# Altium schematic sheet OVERVIEW.SchDoc
size A; SheetNumber: 1; SheetTotal: 3
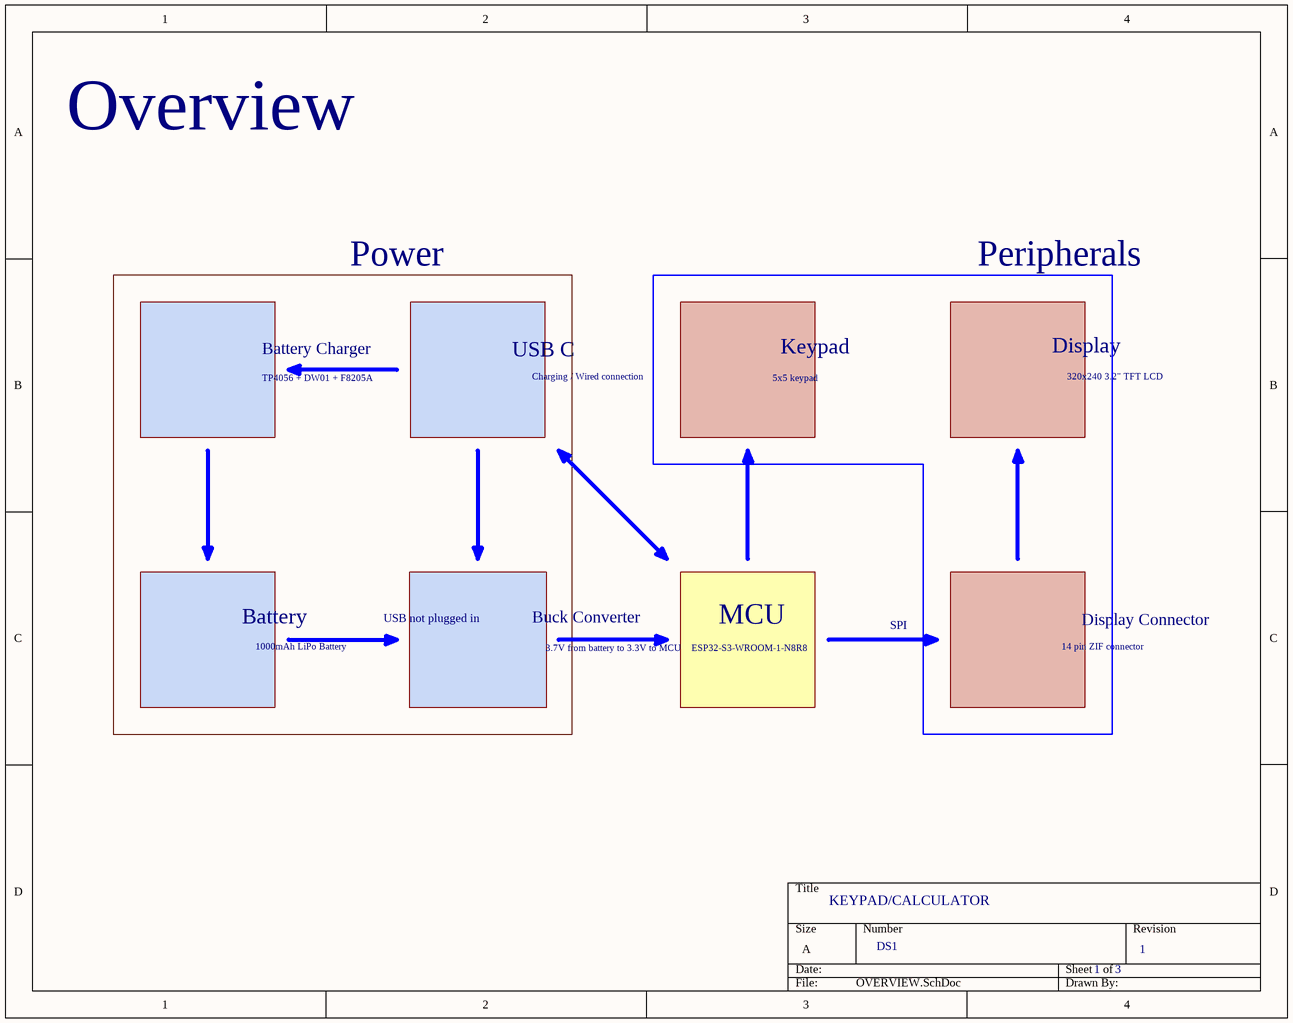
[diagram p0: OVERVIEW.SchDoc]

## Notes on the sheet
- Overview
- Power
- Peripherals
- Battery Charger
- USB C
- Keypad
- Display
- TP4056 + DW01 + F8205A
- Charging / Wired connection
- 5x5 keypad
- 320x240 3.2" TFT LCD
- Battery
- USB not plugged in
- Buck Converter
- MCU
- SPI
- Display Connector
- 1000mAh LiPo Battery
- 3.7V from battery to 3.3V to MCU
- ESP32-S3-WROOM-1-N8R8
- 14 pin ZIF connector
- KEYPAD/CALCULATOR
- DS1
- 1     3
- 1